# Altium schematic sheet Current Sense parts.SchDoc
size A2
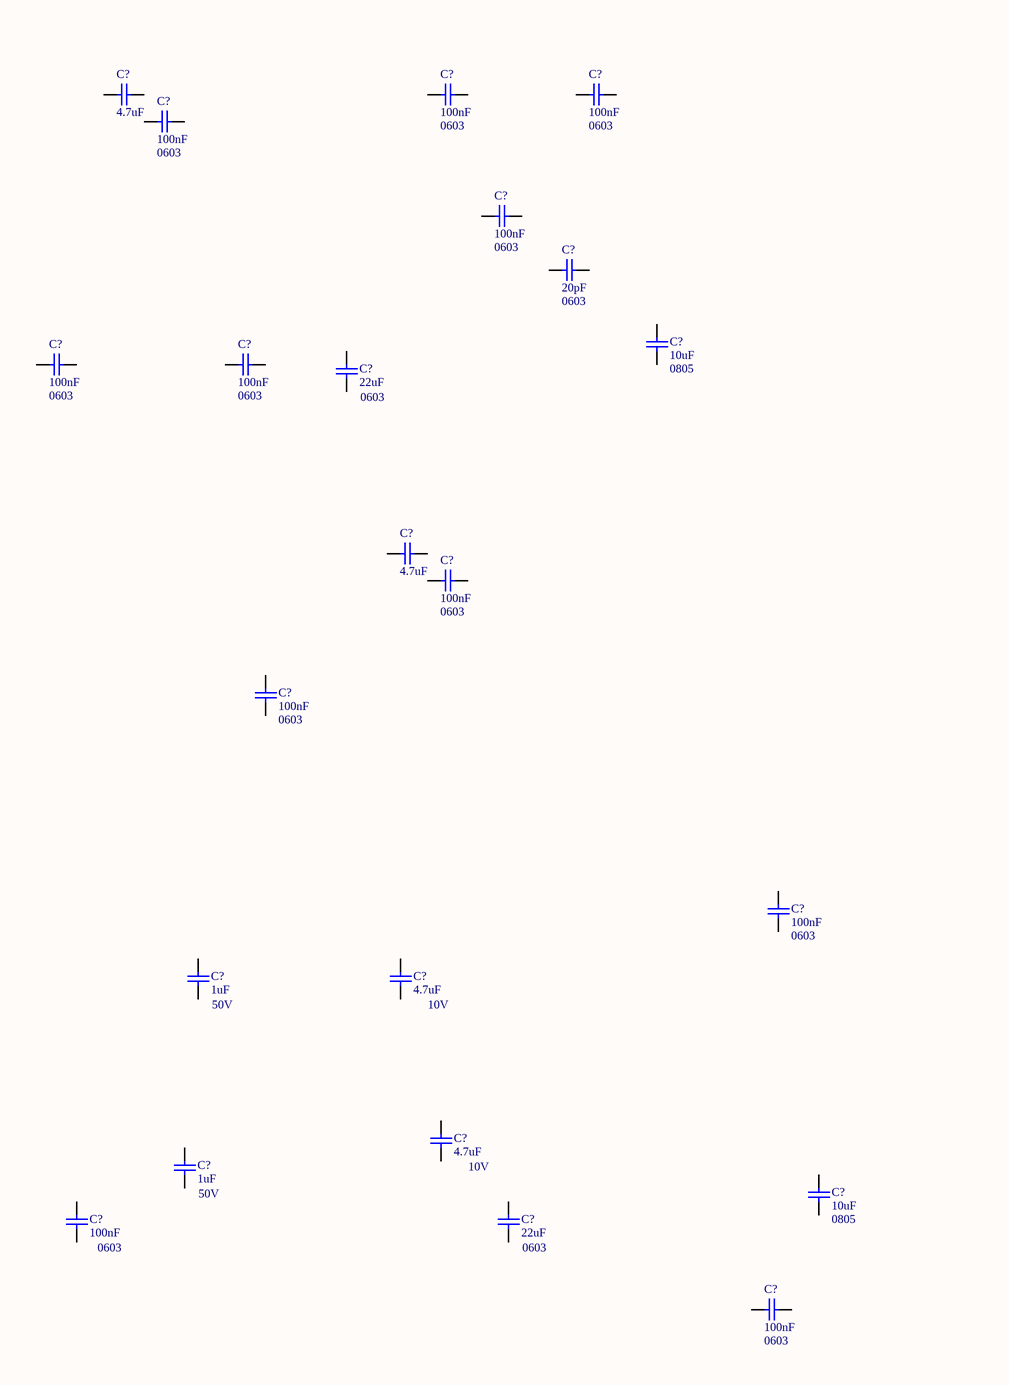
[diagram p0: Current Sense parts.SchDoc, left]
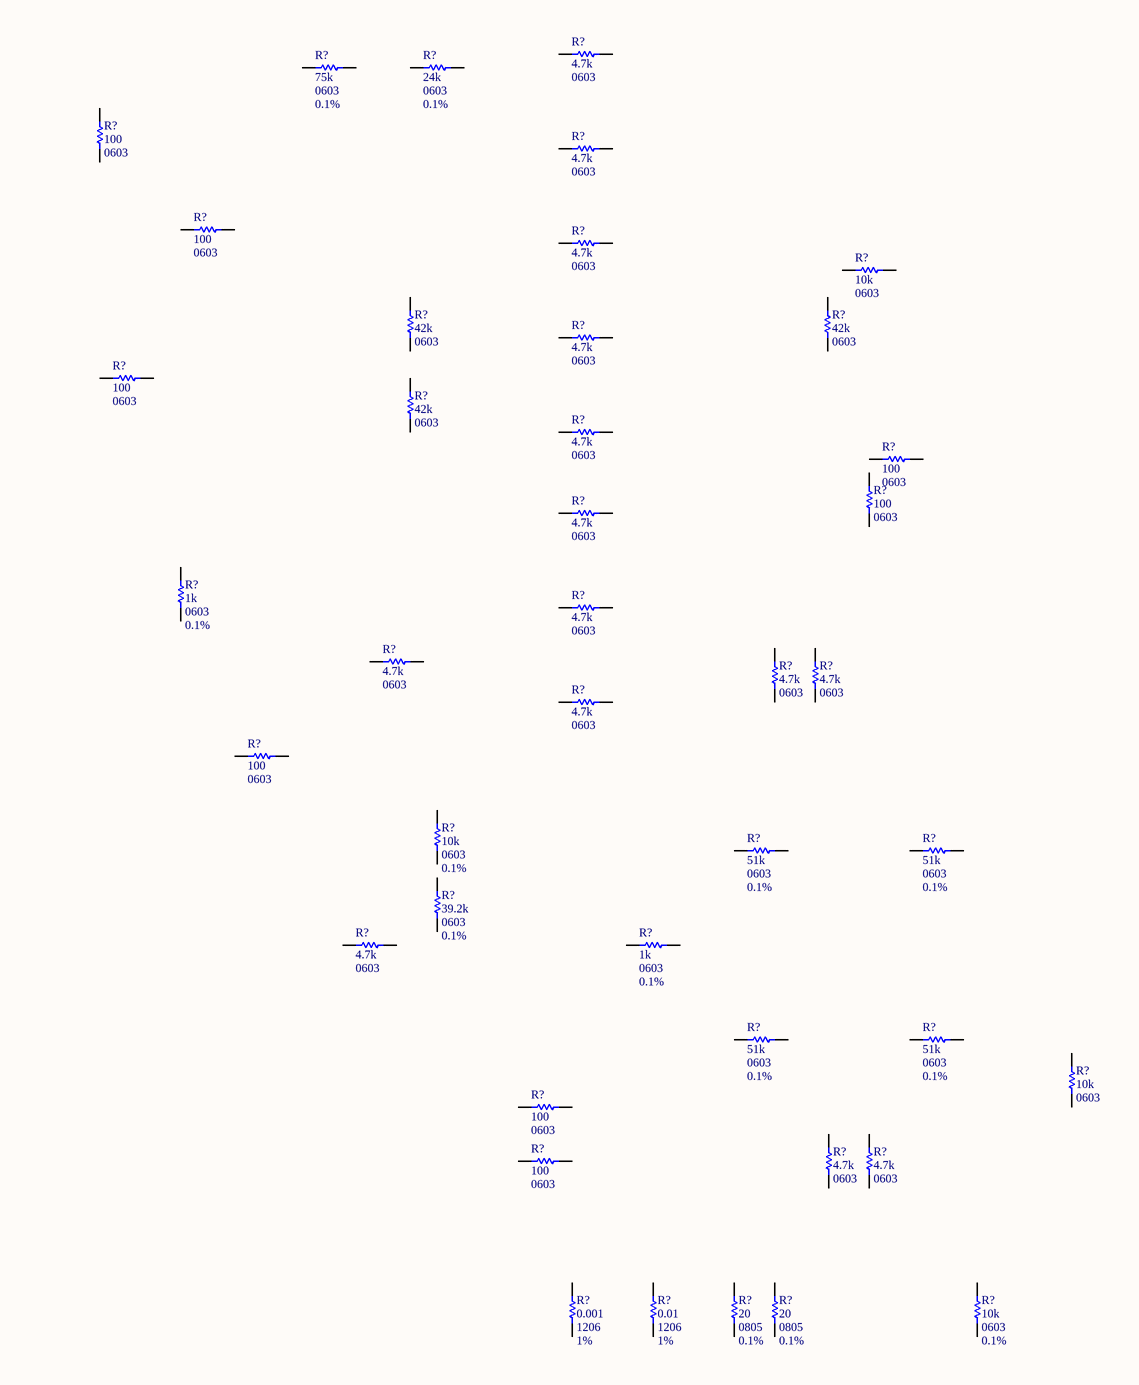
[diagram p1: Current Sense parts.SchDoc, right]

## Parts
(Parts that share a designator on the sheet are numbered #1, #2 ... from top to bottom, then left to right.)
C?#1  4.7uF  [CAPC1608X09N]
C?#2  100nF  Package / Case: 0603  [CAPC1608X09N]
C?#3  100nF  Package / Case: 0603  [CAPC1608X09N]
C?#4  100nF  Package / Case: 0603  [CAPC1608X09N]
C?#5  100nF  Package / Case: 0603  [CAPC1608X09N]
C?#6  20pF  Package / Case: 0603  [CAPC1608X09N]
C?#7  100nF  Package / Case: 0603  [CAPC1608X09N]
C?#8  100nF  Package / Case: 0603  [CAPC1608X09N]
C?#9  10uF  Package / Case: 0805  [C0805]
C?#10  22uF  Package / Case: 0603  [CAPC1608X09N]
C?#11  4.7uF  [CAPC1608X09N]
C?#12  100nF  Package / Case: 0603  [CAPC1608X09N]
C?#13  100nF  Package / Case: 0603  [CAPC1608X09N]
C?#14  100nF  Package / Case: 0603  [CAPC1608X09N]
C?#15  1uF  Voltage-Rated: 50V  [CAPC1608X09N]
C?#16  4.7uF  Voltage-Rated: 10V  [CAPC1608X09N]
C?#17  4.7uF  Voltage-Rated: 10V  [CAPC1608X09N]
C?#18  1uF  Voltage-Rated: 50V  [CAPC1608X09N]
C?#19  10uF  Package / Case: 0805  [C0805]
C?#20  100nF  Package / Case: 0603  [CAPC1608X09N]
C?#21  22uF  Package / Case: 0603  [CAPC1608X09N]
C?#22  100nF  Package / Case: 0603  [CAPC1608X09N]
R?#1  4.7k  Package / Case: 0603  [gen0603-2]
R?#2  75k  Package / Case: 0603  Resistance Tolerance: 0.1%  [gen0603-2]
R?#3  24k  Package / Case: 0603  Resistance Tolerance: 0.1%  [gen0603-2]
R?#4  100  Package / Case: 0603  [gen0603-2]
R?#5  4.7k  Package / Case: 0603  [gen0603-2]
R?#6  100  Package / Case: 0603  [gen0603-2]
R?#7  4.7k  Package / Case: 0603  [gen0603-2]
R?#8  10k  Package / Case: 0603  [gen0603-2]
R?#9  42k  Package / Case: 0603  [gen0603-2]
R?#10  42k  Package / Case: 0603  [gen0603-2]
R?#11  4.7k  Package / Case: 0603  [gen0603-2]
R?#12  100  Package / Case: 0603  [gen0603-2]
R?#13  42k  Package / Case: 0603  [gen0603-2]
R?#14  4.7k  Package / Case: 0603  [gen0603-2]
R?#15  100  Package / Case: 0603  [gen0603-2]
R?#16  4.7k  Package / Case: 0603  [gen0603-2]
R?#17  100  Package / Case: 0603  [gen0603-2]
R?#18  1k  Package / Case: 0603  Resistance Tolerance: 0.1%  [gen0603-2]
R?#19  4.7k  Package / Case: 0603  [gen0603-2]
R?#20  4.7k  Package / Case: 0603  [gen0603-2]
R?#21  4.7k  Package / Case: 0603  [gen0603-2]
R?#22  4.7k  Package / Case: 0603  [gen0603-2]
R?#23  4.7k  Package / Case: 0603  [gen0603-2]
R?#24  100  Package / Case: 0603  [gen0603-2]
R?#25  10k  Package / Case: 0603  Resistance Tolerance: 0.1%  [gen0603-2]
R?#26  51k  Package / Case: 0603  Resistance Tolerance: 0.1%  [gen0603-2]
R?#27  51k  Package / Case: 0603  Resistance Tolerance: 0.1%  [gen0603-2]
R?#28  39.2k  Package / Case: 0603  Resistance Tolerance: 0.1%  [gen0603-2]
R?#29  4.7k  Package / Case: 0603  [gen0603-2]
R?#30  1k  Package / Case: 0603  Resistance Tolerance: 0.1%  [gen0603-2]
R?#31  51k  Package / Case: 0603  Resistance Tolerance: 0.1%  [gen0603-2]
R?#32  51k  Package / Case: 0603  Resistance Tolerance: 0.1%  [gen0603-2]
R?#33  10k  Package / Case: 0603  [gen0603-2]
R?#34  100  Package / Case: 0603  [gen0603-2]
R?#35  100  Package / Case: 0603  [gen0603-2]
R?#36  4.7k  Package / Case: 0603  [gen0603-2]
R?#37  4.7k  Package / Case: 0603  [gen0603-2]
R?#38  0.001  Package / Case: 1206  Resistance Tolerance: 1%  [RESC3116X07M]
R?#39  0.01  Package / Case: 1206  Resistance Tolerance: 1%  [RESC3116X07M]
R?#40  20  Package / Case: 0805  Resistance Tolerance: 0.1%  [PCB-p5gaxfzqzpvl2g018b4o-1]
R?#41  20  Package / Case: 0805  Resistance Tolerance: 0.1%  [PCB-p5gaxfzqzpvl2g018b4o-1]
R?#42  10k  Package / Case: 0603  Resistance Tolerance: 0.1%  [gen0603-2]

## Nets

Not connected (* = marked no-connect by the designer): C?#1 1 2; C?#2 1 2; C?#3 1 2; C?#4 1 2; C?#5 1 2; C?#6 1 2; C?#7 1 2; C?#8 1 2; C?#9 1 2; C?#10 1 2; C?#11 1 2; C?#12 1 2; C?#13 1 2; C?#14 1 2; C?#15 1 2; C?#16 1 2; C?#17 1 2; C?#18 1 2; C?#19 1 2; C?#20 1 2; C?#21 1 2; C?#22 1 2; R?#1 1 2; R?#2 1 2; R?#3 1 2; R?#4 1 2; R?#5 1 2; R?#6 1 2; R?#7 1 2; R?#8 1 2; R?#9 1 2; R?#10 1 2; R?#11 1 2; R?#12 1 2; R?#13 1 2; R?#14 1 2; R?#15 1 2; R?#16 1 2; R?#17 1 2; R?#18 1 2; R?#19 1 2; R?#20 1 2; R?#21 1 2; R?#22 1 2; R?#23 1 2; R?#24 1 2; R?#25 1 2; R?#26 1 2; R?#27 1 2; R?#28 1 2; R?#29 1 2; R?#30 1 2; R?#31 1 2; R?#32 1 2; R?#33 1 2; R?#34 1 2; R?#35 1 2; R?#36 1 2; R?#37 1 2; R?#38 1 2; R?#39 1 2; R?#40 1 2; R?#41 1 2; R?#42 1 2

## Library data of the parts
C?#1 C?#11 = CMP-2f55e5122ad9f092-5: 0603 10 nF 50 V ± 10% Tolerance X7R Surface Mount Multilayer Ceramic Capacitor; Manufacture Part Number: CL10A475KP8NNNC; Manufacturer: Samsung Electro-Mechanics; Voltage-Rated: 10V; Capacitance: 4.7uF; Package / Case: 0603; Supplier: LCSC; Supplier Part Number: C1705; Capacitance Tolerance: 10%
C?#2-C?#5 C?#7 C?#8 C?#12-C?#14 C?#20 C?#22 = CMP-2f55e5122ad9f092-5: 0603 10 nF 50 V ± 10% Tolerance X7R Surface Mount Multilayer Ceramic Capacitor; Manufacture Part Number: CC0603KRX7R9BB104; Manufacturer: YAGEO; Voltage-Rated: 50V; Capacitance Tolerance: 10%; Capacitance: 100nF; Supplier: LCSC; Supplier Part Number: C14663
C?#6 = CMP-2f55e5122ad9f092-5: 0603 10 nF 50 V ± 10% Tolerance X7R Surface Mount Multilayer Ceramic Capacitor; Manufacture Part Number: CC0603JRNPO9BN200; Manufacturer: YAGEO; Voltage-Rated: 50V; Capacitance Tolerance: 5%; Capacitance: 20pF; Supplier: LCSC; Supplier Part Number: C105621
C?#9 C?#19 = CMP-135114-3: Cap Ceramic 0.1uF 50V X7R 10% SMD 0805 125C Embossed T/R; Manufacture Part Number: CL21B106KOQNNNE; Manufacturer: Samsung Electro-Mechanics; Voltage-Rated: 16V; Capacitance Tolerance: *; Capacitance: 10uF; Supplier: LCSC; Supplier Part Number: C95841
C?#10 C?#21 = CMP-2f55e5122ad9f092-5: 0603 10 nF 50 V ± 10% Tolerance X7R Surface Mount Multilayer Ceramic Capacitor; Manufacture Part Number: CL10A226MP8NUNE; Manufacturer: Samsung Electro-Mechanics; Capacitance Tolerance: 20%; Voltage-Rated: 10V; Capacitance: 22uF; Supplier: LCSC; Supplier Part Number: C86295
C?#15 C?#18 = CMP-2f55e5122ad9f092-5: 0603 10 nF 50 V ± 10% Tolerance X7R Surface Mount Multilayer Ceramic Capacitor; Manufacture Part Number: CL21B105KBFNNNE; Manufacturer: Samsung Electro-Mechanics; Capacitance: 1uF; Package / Case: 0603; Supplier: LCSC; Supplier Part Number: C28323; Capacitance Tolerance: 10%
C?#16 C?#17 = CMP-2f55e5122ad9f092-5: 0603 10 nF 50 V ± 10% Tolerance X7R Surface Mount Multilayer Ceramic Capacitor; Manufacture Part Number: CL10A475KP8NNNC; Manufacturer: Samsung Electro-Mechanics; Capacitance: 4.7uF; Package / Case: 0603; Supplier: LCSC; Supplier Part Number: C1705; Capacitance Tolerance: 10%
R?#1 R?#5 R?#7 R?#11 R?#14 R?#16 R?#19-R?#23 R?#29 R?#36 R?#37 = CMP-1853278-27: Surface Mount Thick Film Resistor, RC Series, 1 kohm, 100 mW, - 1%, 50 V, 0603 [1608 Metric]; Manufacturer Part Number: RC0603FR-074K7L; Manufacturer: YAGEO; Resistance: 4.7k; Resistance Tolerance: 1%; Supplier: LCSC; Supplier Part Number: C99782
R?#2 = CMP-1853278-27: Surface Mount Thick Film Resistor, RC Series, 1 kohm, 100 mW, - 1%, 50 V, 0603 [1608 Metric]; Manufacturer Part Number: ERJPB3B7502V; Manufacturer: PANASONIC; Resistance: 75k; Supplier: LCSC; Supplier Part Number: C413688
R?#3 = CMP-1853278-27: Surface Mount Thick Film Resistor, RC Series, 1 kohm, 100 mW, - 1%, 50 V, 0603 [1608 Metric]; Manufacturer Part Number: ERJPB3B2402V; Manufacturer: PANASONIC; Resistance: 24k; Supplier: LCSC; Supplier Part Number: C413706
R?#4 R?#6 R?#12 R?#15 R?#17 R?#24 R?#34 R?#35 = CMP-1853278-27: Surface Mount Thick Film Resistor, RC Series, 1 kohm, 100 mW, - 1%, 50 V, 0603 [1608 Metric]; Manufacturer Part Number: 0603WAF1000T5E; Manufacturer: UNI-ROYAL(Uniroyal Elec); Resistance: 100; Resistance Tolerance: 1%; Supplier: LCSC; Supplier Part Number: C22775
R?#8 R?#33 = CMP-1853278-27: Surface Mount Thick Film Resistor, RC Series, 1 kohm, 100 mW, - 1%, 50 V, 0603 [1608 Metric]; Manufacturer Part Number: RC0603FR-0710KL; Manufacturer: YAGEO; Resistance: 10k; Resistance Tolerance: 1%; Supplier: LCSC; Supplier Part Number: C98220
R?#9 R?#10 R?#13 = CMP-1853278-27: Surface Mount Thick Film Resistor, RC Series, 1 kohm, 100 mW, - 1%, 50 V, 0603 [1608 Metric]; Manufacturer Part Number: 0603WAF4222T5E; Manufacturer: UNI-ROYAL(Uniroyal Elec); Resistance: 42k; Resistance Tolerance: 1%; Supplier: LCSC; Supplier Part Number: C23167
R?#18 R?#30 = CMP-1853278-27: Surface Mount Thick Film Resistor, RC Series, 1 kohm, 100 mW, - 1%, 50 V, 0603 [1608 Metric]; Manufacturer Part Number: ERJPB3B1001V; Manufacturer: PANASONIC; Resistance: 1k; Supplier: LCSC; Supplier Part Number: C193680
R?#25 R?#42 = CMP-1853278-27: Surface Mount Thick Film Resistor, RC Series, 1 kohm, 100 mW, - 1%, 50 V, 0603 [1608 Metric]; Manufacturer Part Number: WF06Q1002BTL; Manufacturer: Walsin Tech Corp; Resistance: 10k; Supplier: LCSC; Supplier Part Number: C305259
R?#26 R?#27 R?#31 R?#32 = CMP-1853278-27: Surface Mount Thick Film Resistor, RC Series, 1 kohm, 100 mW, - 1%, 50 V, 0603 [1608 Metric]; Manufacturer Part Number: ERJPB3B5102V; Manufacturer: PANASONIC; Resistance: 51k; Supplier: LCSC; Supplier Part Number: C413694
R?#28 = CMP-1853278-27: Surface Mount Thick Film Resistor, RC Series, 1 kohm, 100 mW, - 1%, 50 V, 0603 [1608 Metric]; Manufacturer Part Number: ERA3AEB3922V; Manufacturer: PANASONIC; Resistance: 39.2k; Supplier: LCSC; Supplier Part Number: C491129
R?#38 = CMP-90ca5a8d69034f0d-5: Res Thick Film 3.2 x 1.6 mm 10K Ohm 1% 0.25W(1/4W) 100ppm/ C Molded SMD Paper T/R; Manufacture Part Number: MA120610FR001SZ; Manufacturer: Ever Ohms Tech; Resistance: 0.001; Supplier: LCSC; Supplier Part Number: C429334
R?#39 = CMP-90ca5a8d69034f0d-5: Res Thick Film 3.2 x 1.6 mm 10K Ohm 1% 0.25W(1/4W) 100ppm/ C Molded SMD Paper T/R; Manufacture Part Number: PE1206FKE470R01Z; Manufacturer: YAGEO; Resistance: 0.01; Supplier: LCSC; Supplier Part Number: C364375
R?#40 R?#41 = CMP-f2923ac3d6042d55-1: Res Thin Film 0805 4.99 Ohm 0.1% 1/8W ±15ppm/°C Molded SMD SMD Paper T/R; Manufacture Part Number: MCWF08U20R0BTL; Manufacturer: Multicomp; Resistance: 20; Supplier: LCSC; Supplier Part Number: C241306